# EAGLE schematic cpubus (EAGLE 7.3.0)
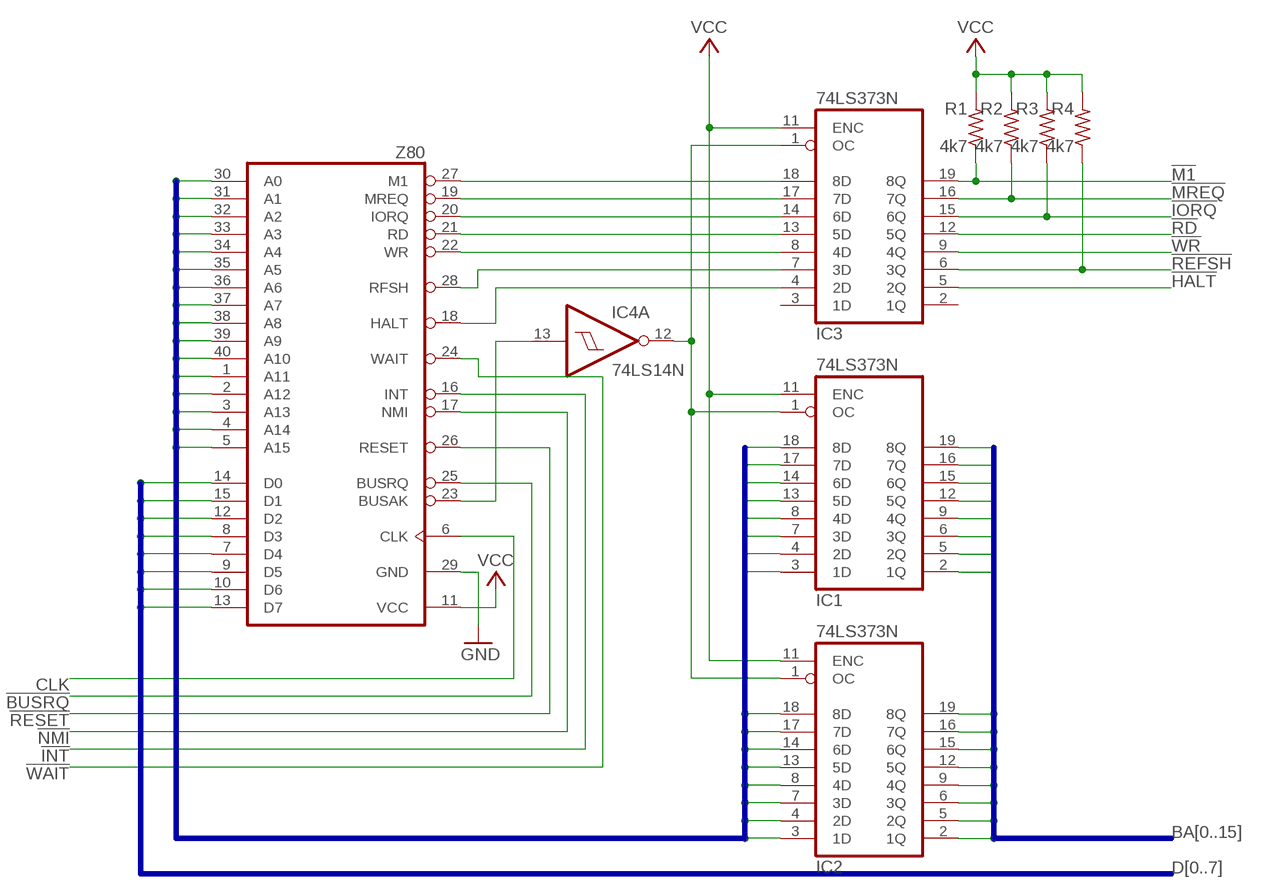
[diagram p0: schematic, sheet 1]

## Parts
IC1  74LS373N  [DIL20]
IC2  74LS373N  [DIL20]
IC3  74LS373N  [DIL20]
IC4  74LS14N  [DIL14]
R1  4k7  R-US_0204/7  [0204/7]
R2  4k7  R-US_0204/7  [0204/7]
R3  4k7  R-US_0204/7  [0204/7]
R4  4k7  R-US_0204/7  [0204/7]
Z80  Z80CPU  [DIL40]

## Nets
!BUSACK!: IC4.13(A:I) Z80.23(BUSAK)
!BUSRQ!: Z80.25(BUSRQ)
!HALT!: IC3.5(2Q)
!INT!: Z80.16(INT)
!IORQ!: IC3.15(6Q) R3.1
!M1!: IC3.19(8Q) R1.1
!MREQ!: IC3.16(7Q) R2.1
!NMI!: Z80.17(NMI)
!RD!: IC3.12(5Q)
!REFSH!: IC3.6(3Q) R4.1
!RESET!: Z80.26(RESET)
!WAIT!: Z80.24(WAIT)
!WR!: IC3.9(4Q)
A0: IC1.18(8D) Z80.30(A0)
A1: IC1.17(7D) Z80.31(A1)
A2: IC1.14(6D) Z80.32(A2)
A3: IC1.13(5D) Z80.33(A3)
A4: IC1.8(4D) Z80.34(A4)
A5: IC1.7(3D) Z80.35(A5)
A6: IC1.4(2D) Z80.36(A6)
A7: IC1.3(1D) Z80.37(A7)
A8: IC2.18(8D) Z80.38(A8)
A9: IC2.17(7D) Z80.39(A9)
A10: IC2.14(6D) Z80.40(A10)
A11: IC2.13(5D) Z80.1(A11)
A12: IC2.8(4D) Z80.2(A12)
A13: IC2.7(3D) Z80.3(A13)
A14: IC2.4(2D) Z80.4(A14)
A15: IC2.3(1D) Z80.5(A15)
BA0: IC1.19(8Q)
BA1: IC1.16(7Q)
BA2: IC1.15(6Q)
BA3: IC1.12(5Q)
BA4: IC1.9(4Q)
BA5: IC1.6(3Q)
BA6: IC1.5(2Q)
BA7: IC1.2(1Q)
BA8: IC2.19(8Q)
BA9: IC2.16(7Q)
BA10: IC2.15(6Q)
BA11: IC2.12(5Q)
BA12: IC2.9(4Q)
BA13: IC2.6(3Q)
BA14: IC2.5(2Q)
BA15: IC2.2(1Q)
CLK: Z80.6(CLK)
D0: Z80.14(D0)
D1: Z80.15(D1)
D2: Z80.12(D2)
D3: Z80.8(D3)
D4: Z80.7(D4)
D5: Z80.9(D5)
D6: Z80.10(D6)
D7: Z80.13(D7)
GND: Z80.29(GND)
N$1: IC1.1(OC) IC2.1(OC) IC3.1(OC) IC4.12(A:O)
N$8: IC3.18(8D) Z80.27(M1)
N$9: IC3.17(7D) Z80.19(MREQ)
N$12: IC3.14(6D) Z80.20(IORQ)
N$13: IC3.13(5D) Z80.21(RD)
N$14: IC3.8(4D) Z80.22(WR)
N$15: IC3.7(3D) Z80.28(RFSH)
N$16: IC3.4(2D) Z80.18(HALT)
VCC: IC1.11(ENC) IC2.11(ENC) IC3.11(ENC) R1.2 R2.2 R3.2 R4.2 Z80.11(VCC)
Unconnected: IC3.2(1Q) IC3.3(1D) IC4.1(D:I) IC4.2(D:O) IC4.3(E:I) IC4.4(E:O) IC4.5(F:I) IC4.6(F:O) IC4.8(C:O) IC4.9(C:I) IC4.10(B:O) IC4.11(B:I)

## Buses
A[0..15]
BA[0..15]
D[0..7]

## Power pins joined to a net without a drawn wire
GND: IC1.10(GND) IC2.10(GND) IC3.10(GND) IC4.7(P:GND)
VCC: IC1.20(VCC) IC2.20(VCC) IC3.20(VCC) IC4.14(P:VCC)

## Library data of the parts
IC1-IC3 = 74xx-eu:74*373: Octal D type transparent LATCH, edge triggered
IC4 = 74xx-eu:74*14: Hex schmitt trigger INVERTER
R1-R4 = resistor:R-US_: RESISTOR, American symbol
Z80 = zilog:Z80CPU: Z80 FAMILY DEVICE